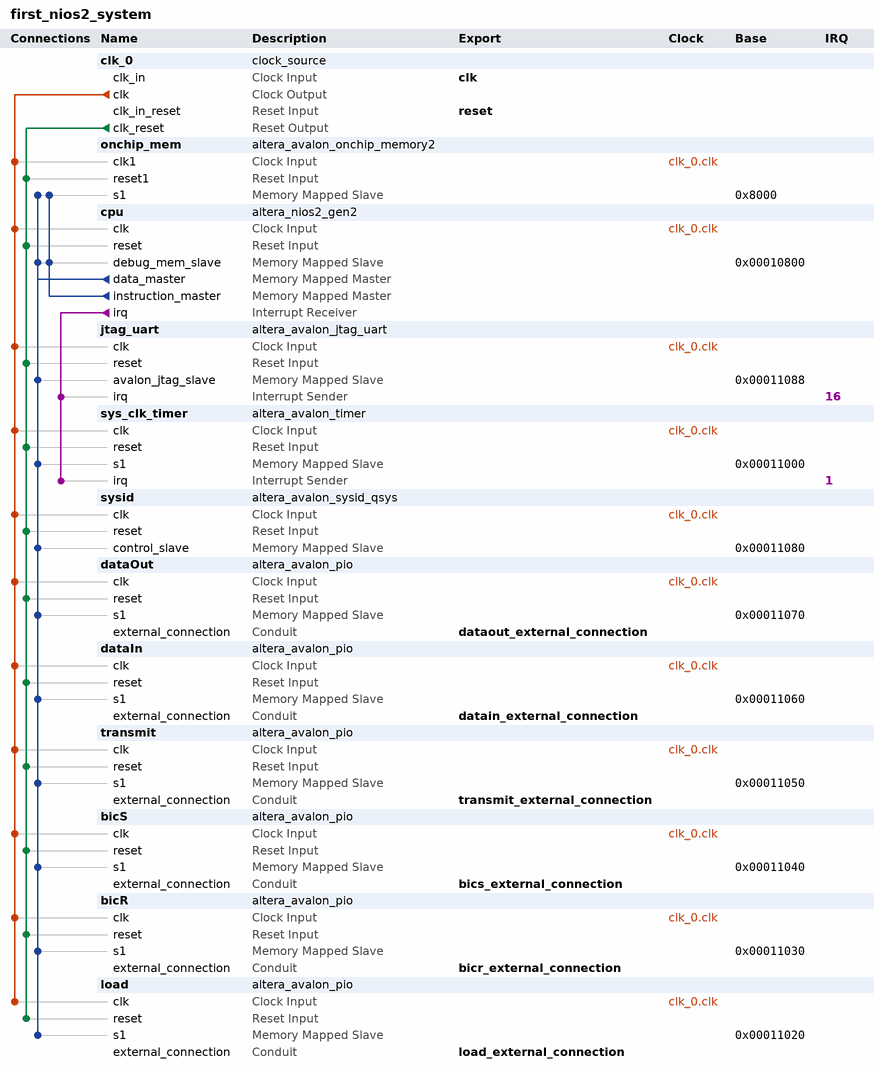
[diagram p0: system contents]
# Platform Designer (Qsys) system first_nios2_system, Cyclone V 5CSEMA5F31C6
# Parameters at their usual value, and those the tool derives, are not listed.
package require -exact qsys 17.0
create_system first_nios2_system
set_project_property DEVICE_FAMILY {Cyclone V}
set_project_property DEVICE 5CSEMA5F31C6

add_instance clk_0 clock_source 17.0
set_instance_parameter_value clk_0 clockFrequency 50000000

add_instance onchip_mem altera_avalon_onchip_memory2 17.0
set_instance_parameter_value onchip_mem dataWidth 32
set_instance_parameter_value onchip_mem dualPort false
set_instance_parameter_value onchip_mem initMemContent true
set_instance_parameter_value onchip_mem initializationFileName onchip_mem.hex
set_instance_parameter_value onchip_mem memorySize 20480

add_instance cpu altera_nios2_gen2 17.0
set_instance_parameter_value cpu dcache_size 0
set_instance_parameter_value cpu exceptionSlave onchip_mem.s1
set_instance_parameter_value cpu icache_size 2048
set_instance_parameter_value cpu impl Fast
set_instance_parameter_value cpu resetSlave onchip_mem.s1
set_instance_parameter_value cpu setting_activateTrace true

add_instance jtag_uart altera_avalon_jtag_uart 17.0
set_instance_parameter_value jtag_uart simInteractiveOptions NO_INTERACTIVE_WINDOWS

add_instance sys_clk_timer altera_avalon_timer 17.0
set_instance_parameter_value sys_clk_timer period 1
set_instance_parameter_value sys_clk_timer periodUnits MSEC

add_instance sysid altera_avalon_sysid_qsys 17.0
set_instance_parameter_value sysid id 0

add_instance dataOut altera_avalon_pio 17.0
set_instance_parameter_value dataOut direction Output
set_instance_parameter_value dataOut width 8

add_instance dataIn altera_avalon_pio 17.0
set_instance_parameter_value dataIn direction Input
set_instance_parameter_value dataIn width 8

add_instance transmit altera_avalon_pio 17.0
set_instance_parameter_value transmit direction Output
set_instance_parameter_value transmit width 1

add_instance bicS altera_avalon_pio 17.0
set_instance_parameter_value bicS direction Input
set_instance_parameter_value bicS width 4

add_instance bicR altera_avalon_pio 17.0
set_instance_parameter_value bicR direction Input
set_instance_parameter_value bicR width 4

add_instance load altera_avalon_pio 17.0
set_instance_parameter_value load direction Output
set_instance_parameter_value load width 1

# connections
add_connection clk_0.clk bicR.clk clock
add_connection clk_0.clk bicS.clk clock
add_connection clk_0.clk cpu.clk clock
add_connection clk_0.clk dataIn.clk clock
add_connection clk_0.clk dataOut.clk clock
add_connection clk_0.clk jtag_uart.clk clock
add_connection clk_0.clk load.clk clock
add_connection clk_0.clk onchip_mem.clk1 clock
add_connection clk_0.clk sys_clk_timer.clk clock
add_connection clk_0.clk sysid.clk clock
add_connection clk_0.clk transmit.clk clock
add_connection clk_0.clk_reset bicR.reset reset
add_connection clk_0.clk_reset bicS.reset reset
add_connection clk_0.clk_reset cpu.reset reset
add_connection clk_0.clk_reset dataIn.reset reset
add_connection clk_0.clk_reset dataOut.reset reset
add_connection clk_0.clk_reset jtag_uart.reset reset
add_connection clk_0.clk_reset load.reset reset
add_connection clk_0.clk_reset onchip_mem.reset1 reset
add_connection clk_0.clk_reset sys_clk_timer.reset reset
add_connection clk_0.clk_reset sysid.reset reset
add_connection clk_0.clk_reset transmit.reset reset
add_connection cpu.data_master bicR.s1 avalon
set_connection_parameter_value cpu.data_master/bicR.s1 baseAddress 0x00011030
add_connection cpu.data_master bicS.s1 avalon
set_connection_parameter_value cpu.data_master/bicS.s1 baseAddress 0x00011040
add_connection cpu.data_master cpu.debug_mem_slave avalon
set_connection_parameter_value cpu.data_master/cpu.debug_mem_slave baseAddress 0x00010800
add_connection cpu.data_master dataIn.s1 avalon
set_connection_parameter_value cpu.data_master/dataIn.s1 baseAddress 0x00011060
add_connection cpu.data_master dataOut.s1 avalon
set_connection_parameter_value cpu.data_master/dataOut.s1 baseAddress 0x00011070
add_connection cpu.data_master jtag_uart.avalon_jtag_slave avalon
set_connection_parameter_value cpu.data_master/jtag_uart.avalon_jtag_slave baseAddress 0x00011088
add_connection cpu.data_master load.s1 avalon
set_connection_parameter_value cpu.data_master/load.s1 baseAddress 0x00011020
add_connection cpu.data_master onchip_mem.s1 avalon
set_connection_parameter_value cpu.data_master/onchip_mem.s1 baseAddress 0x8000
add_connection cpu.data_master sys_clk_timer.s1 avalon
set_connection_parameter_value cpu.data_master/sys_clk_timer.s1 baseAddress 0x00011000
add_connection cpu.data_master sysid.control_slave avalon
set_connection_parameter_value cpu.data_master/sysid.control_slave baseAddress 0x00011080
add_connection cpu.data_master transmit.s1 avalon
set_connection_parameter_value cpu.data_master/transmit.s1 baseAddress 0x00011050
add_connection cpu.instruction_master cpu.debug_mem_slave avalon
set_connection_parameter_value cpu.instruction_master/cpu.debug_mem_slave baseAddress 0x00010800
add_connection cpu.instruction_master onchip_mem.s1 avalon
set_connection_parameter_value cpu.instruction_master/onchip_mem.s1 baseAddress 0x8000
add_connection cpu.irq jtag_uart.irq interrupt
set_connection_parameter_value cpu.irq/jtag_uart.irq irqNumber 16
add_connection cpu.irq sys_clk_timer.irq interrupt
set_connection_parameter_value cpu.irq/sys_clk_timer.irq irqNumber 1

# exported interfaces
add_interface bicr_external_connection conduit end
set_interface_property bicr_external_connection EXPORT_OF bicR.external_connection
add_interface bics_external_connection conduit end
set_interface_property bics_external_connection EXPORT_OF bicS.external_connection
add_interface clk clock sink
set_interface_property clk EXPORT_OF clk_0.clk_in
add_interface datain_external_connection conduit end
set_interface_property datain_external_connection EXPORT_OF dataIn.external_connection
add_interface dataout_external_connection conduit end
set_interface_property dataout_external_connection EXPORT_OF dataOut.external_connection
add_interface load_external_connection conduit end
set_interface_property load_external_connection EXPORT_OF load.external_connection
add_interface reset reset sink
set_interface_property reset EXPORT_OF clk_0.clk_in_reset
add_interface transmit_external_connection conduit end
set_interface_property transmit_external_connection EXPORT_OF transmit.external_connection

set_interconnect_requirement {$system} qsys_mm.clockCrossingAdapter HANDSHAKE
set_interconnect_requirement {$system} qsys_mm.insertDefaultSlave FALSE
set_interconnect_requirement {$system} qsys_mm.maxAdditionalLatency 1

save_system first_nios2_system.qsys
